# Altium schematic sheet Sequencer.SchDoc
size A4; SheetNumber: 2; SheetTotal: 8
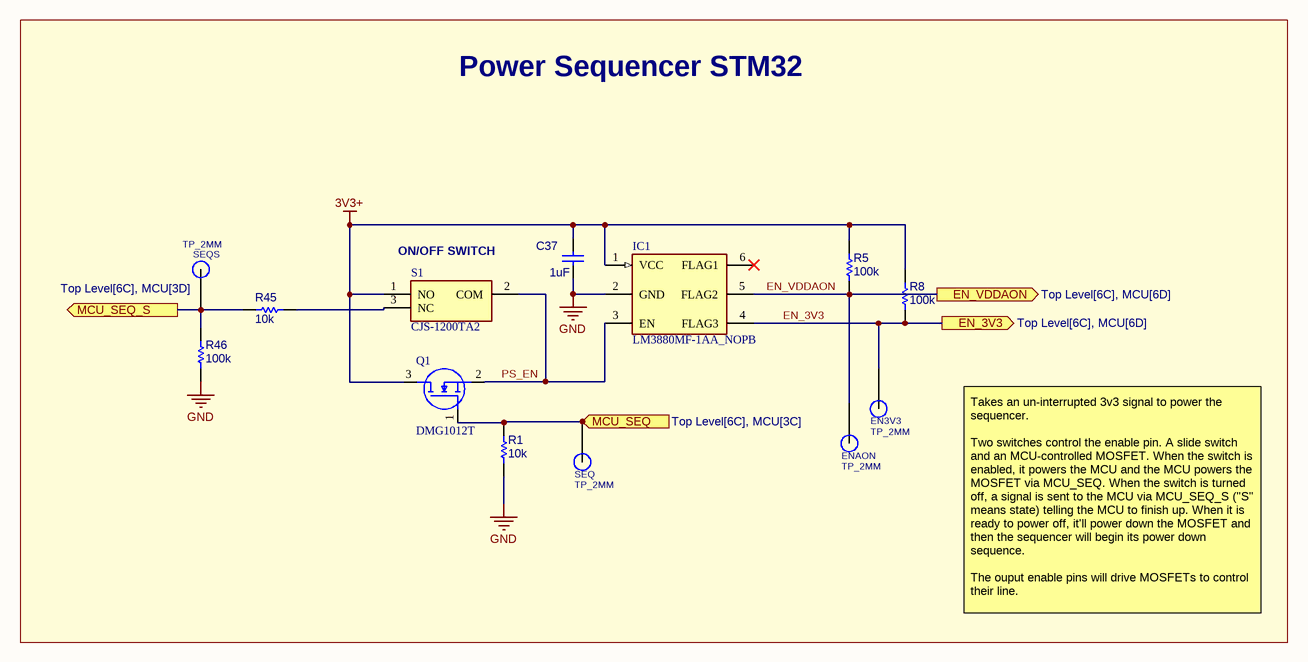
[diagram p0: Sequencer.SchDoc]

## Parts
C37  value 1uF  [C0603]  (hidden comment: MCD-00237)
EN3V3  TP_2MM  [TESTPOINT 2MM]
ENAON  TP_2MM  [TESTPOINT 2MM]
IC1  LM3880MF-1AA_NOPB  [LM3880MF-1AA_NOPB]
Q1  DMG1012T  [SOT50P160X90-3N]
R1  value 10k  [RESC1608X55X25ML10T15-1]  (hidden comment: Resistor 10k +/-1% 0603 100mW)
R5  value 100k  [RESC1608X55X25ML10T15-1]  (hidden comment: Resistor 10k +/-1% 0603 100mW)
R8  value 100k  [RESC1608X55X25ML10T15-1]  (hidden comment: Resistor 10k +/-1% 0603 100mW)
R45  value 10k  [RESC1608X55X25ML10T15-1]  (hidden comment: Resistor 10k +/-1% 0603 100mW)
R46  value 100k  [RESC1608X55X25ML10T15-1]  (hidden comment: Resistor 10k +/-1% 0603 100mW)
S1  CJS-1200TA2  [CJS1200TA2]
SEQ  TP_2MM  [TESTPOINT 2MM]
SEQS  TP_2MM  [TESTPOINT 2MM]

## Ports
EN_3V3 (out, see Top Level[6C], MCU[6D]), EN_VDDAON (out, see Top Level[6C], MCU[6D]), MCU_SEQ (in, see Top Level[6C], MCU[3C]), MCU_SEQ_S (out, see Top Level[6C], MCU[3D])

## Nets
3V3+: C37.2 IC1.1(VCC) Q1.3(D) R5.1 R8.1 S1.1(NO)
GND: C37.1 IC1.2(GND) R1.2 R46.2
EN_3V3: EN3V3.TP(TP_2MM) IC1.4(FLAG3) R8.2 ; port EN_3V3
EN_VDDAON: ENAON.TP(TP_2MM) IC1.5(FLAG2) R5.2 ; port EN_VDDAON
MCU_SEQ: Q1.1(G) R1.1 SEQ.TP(TP_2MM) ; port MCU_SEQ
MCU_SEQ_S: R45.1 R46.1 SEQS.TP(TP_2MM) ; port MCU_SEQ_S
PS_EN: IC1.3(EN) Q1.2(S) S1.2(COM)
NetR45_2: R45.2 S1.3(NC)

Not connected (* = marked no-connect by the designer): IC1 6(FLAG1)*

## Notes on the sheet
- Power Sequencer STM32
- (near S1) ON/OFF SWITCH
- Takes an un-interrupted 3v3 signal to power the sequencer.
  Two switches control the enable pin. A slide switch and an MCU-controlled MOSFET. When the switch is enabled, it powers the MCU and the MCU powers the MOSFET via MCU_SEQ. When the switch is turned off, a signal is sent to the MCU via MCU_SEQ_S ("S" means state) telling the MCU to finish up. When it is ready to power off, it'll power down the MOSFET and then the sequencer will begin its power down sequence.
  The ouput enable pins will drive MOSFETs to control their line.

## Library data of the parts
C37 = CMP-112-000001-1: Capacitor, MLCC, 100nF, 6V3, X5R, 10%, 0603, T=0,8mm; Manufacturer Part Number: CC0603KRX5R5BB104; Manufacturer: YAGEO; ECCN_EU: NEC; Provided_By: SUBCO; ECCN_US: EAR99; Status: Released; ComponentLink1Description: Datasheet; Component Type: Capacitors; Pin Count: 2; Package: C0603; Source: MB1364.SCHLIB; Design Item ID: MCD-00237; Part_Type: Capacitor; Internal_Part_Number: MCD-00237; ComponentLink1URL: http://tunmcdsvn.tun.st.com/Component_Datasheet_Library/Trunk/Capacitors/Yageo_Multilayer_capacitor_X5R_series_100pF_to_100uF; Manufacturer_Part_Number: CC0603KRX5R5BB104
IC1 = LM3880MF-1AA_NOPB: Integrated Circuit; Manufacturer_Name: Texas Instruments; Manufacturer_Part_Number: LM3880MF-1AA/NOPB; Datasheet Link: http://www.ti.com/lit/gpn/lm3880; Height: 1.45mm; Mouser Part Number: 926-LM3880MF-1AANOPB; Mouser Price/Stock: https://www.mouser.co.uk/ProductDetail/Texas-Instruments/LM3880MF-1AA-NOPB?qs=QbsRYf82W3Fi03r6kJUy6g%3D%3D; Arrow Part Number: LM3880MF-1AA/NOPB; Arrow Price/Stock: https://www.arrow.com/en/products/lm3880mf-1aanopb/texas-instruments?region=nac
Q1 = DMG1012T: MOSFET (N-Channel); Manufacturer_Name: Diodes Incorporated; Datasheet Link: https://www.diodes.com/datasheet/download/DMG1012T.pdf; Height: 0.9mm; Manufacturer_Part_Number: DMG1012T; Mouser Part Number: N/A; Mouser Price/Stock: https://www.mouser.co.uk/ProductDetail/Diodes-Incorporated/DMG1012T?qs=Wj%2FVkw3K%252BMD5naxckZUW%2FA%3D%3D
R1 R5 R8 R45 R46 = CMP-009-00181-1: Chip Resistor, 10k Ohm, 0.1 W, -55 to 155 degC, 0603 (1608 Metric); Voltage Rating: 50V; Tolerance: 1%; Source: Components - 14.11.22 - 11.28.SchLib; Design Item ID: CMP-009-00006-5; Created by: Micah Randall; Power: 100mW; Max Operating Temperature: 155°C; RoHS Compliant: Yes; Mounting Technology: SM; Case/Package: 0603; Min Operating Temperature: -55°C; Pins: 2
S1 = CJS-1200TA2: Switch; Manufacturer_Name: Nidec Copal; Datasheet Link: http://www.nidec-copal-electronics.com/j/catalog/switch/cjs.pdf; Height: 2.5mm; Manufacturer_Part_Number: CJS-1200TA2; Mouser Part Number: 229-CJS-1200TA2; Mouser Price/Stock: https://www.mouser.co.uk/ProductDetail/Nidec-Components/CJS-1200TA2?qs=XeJtXLiO41Rf26ws0igWdA%3D%3D